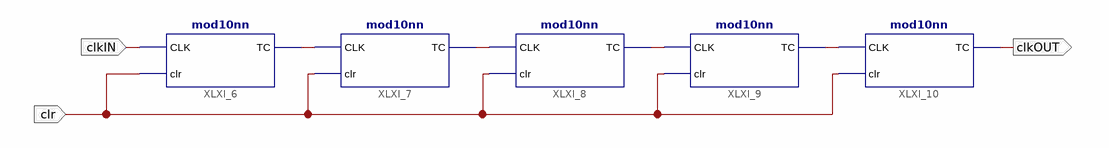
[diagram p0: schematic sheet 1]
// Xilinx ISE schematic Div100knn.sch (spartan6) as structural Verilog: 5 symbols, 3 ports
module Div100knn (
  input  clkIN,
  input  clr,
  output clkOUT
);

  wire XLXN_1, XLXN_2, XLXN_3, XLXN_4;

  mod10nn XLXI_6 (.CLK(clkIN), .clr(clr), .TC(XLXN_1));
  mod10nn XLXI_7 (.CLK(XLXN_1), .clr(clr), .TC(XLXN_2));
  mod10nn XLXI_8 (.CLK(XLXN_2), .clr(clr), .TC(XLXN_3));
  mod10nn XLXI_9 (.CLK(XLXN_3), .clr(clr), .TC(XLXN_4));
  mod10nn XLXI_10 (.CLK(XLXN_4), .clr(clr), .TC(clkOUT));
endmodule
